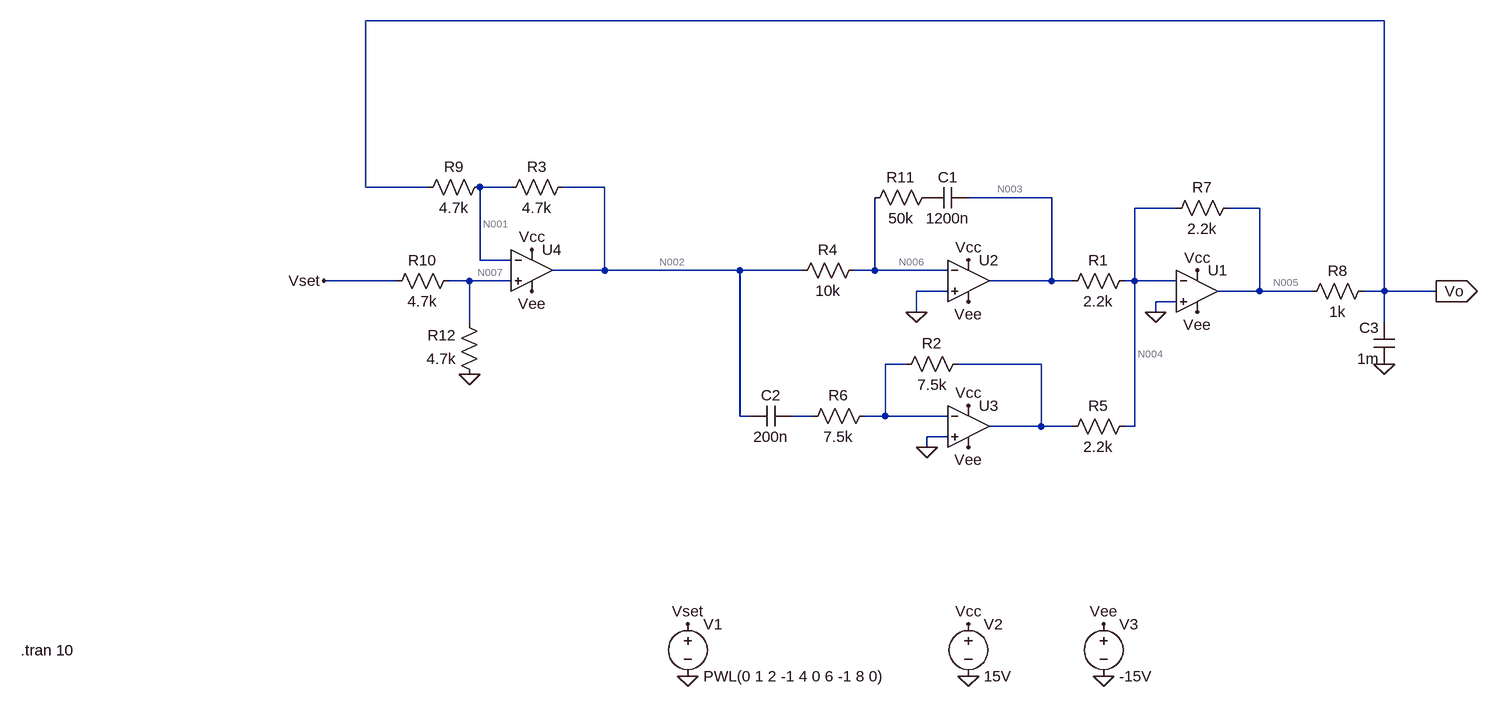
[diagram p0: schematic PID.asc]
PID.asc, the LTspice schematic file:
Version 4
SHEET 1 880 832
WIRE 560 -224 -1008 -224
WIRE -1008 32 -1008 -224
WIRE -912 32 -1008 32
WIRE -784 32 -832 32
WIRE -640 32 -704 32
WIRE 48 48 -80 48
WIRE 240 64 176 64
WIRE 368 64 320 64
WIRE -832 144 -832 32
WIRE -784 144 -832 144
WIRE -640 160 -640 32
WIRE -640 160 -720 160
WIRE -432 160 -640 160
WIRE -336 160 -432 160
WIRE -224 160 -224 48
WIRE -224 160 -256 160
WIRE -112 160 -224 160
WIRE -960 176 -1072 176
WIRE -848 176 -880 176
WIRE -784 176 -848 176
WIRE 48 176 48 48
WIRE 48 176 -48 176
WIRE 80 176 48 176
WIRE 176 176 176 64
WIRE 176 176 160 176
WIRE 240 176 176 176
WIRE -112 192 -160 192
WIRE 368 192 368 64
WIRE 368 192 304 192
WIRE 448 192 368 192
WIRE 560 192 560 -224
WIRE 560 192 528 192
WIRE 640 192 560 192
WIRE 240 208 208 208
WIRE -160 224 -160 192
WIRE 208 224 208 208
WIRE -848 240 -848 176
WIRE 560 240 560 192
WIRE -176 304 -208 304
WIRE 32 304 -96 304
WIRE -432 384 -432 160
WIRE -416 384 -432 384
WIRE -320 384 -352 384
WIRE -208 384 -208 304
WIRE -208 384 -240 384
WIRE -112 384 -208 384
WIRE 32 400 32 304
WIRE 32 400 -48 400
WIRE 80 400 32 400
WIRE 176 400 176 176
WIRE 176 400 160 400
WIRE -112 416 -144 416
WIRE -144 432 -144 416
FLAG -80 784 0
FLAG 128 784 0
FLAG -80 704 Vcc
FLAG 128 704 Vee
FLAG -80 432 Vee
FLAG -80 208 Vee
FLAG 272 224 Vee
FLAG -80 368 Vcc
FLAG -80 144 Vcc
FLAG 272 160 Vcc
FLAG 560 304 0
FLAG -512 784 0
FLAG -144 432 0
FLAG -160 224 0
FLAG 208 224 0
FLAG -752 192 Vee
FLAG -752 128 Vcc
FLAG -848 320 0
FLAG -512 704 Vset
FLAG -1072 176 Vset
FLAG 640 192 Vo
IOPIN 640 192 Out
SYMBOL OpAmps\\UniversalOpamp 272 192 R0
SYMATTR InstName U1
SYMBOL OpAmps\\UniversalOpamp -80 176 R0
SYMATTR InstName U2
SYMBOL OpAmps\\UniversalOpamp -80 400 R0
SYMATTR InstName U3
SYMBOL res 176 160 R90
WINDOW 0 0 56 VBottom 2
WINDOW 3 32 56 VTop 2
SYMATTR InstName R1
SYMATTR Value 2.2k
SYMBOL res -80 288 R90
WINDOW 0 0 56 VBottom 2
WINDOW 3 32 56 VTop 2
SYMATTR InstName R2
SYMATTR Value 7.5k
SYMBOL res -128 32 R90
WINDOW 0 0 56 VBottom 2
WINDOW 3 32 56 VTop 2
SYMATTR InstName R11
SYMATTR Value 50k
SYMBOL res -240 144 R90
WINDOW 0 0 56 VBottom 2
WINDOW 3 32 56 VTop 2
SYMATTR InstName R4
SYMATTR Value 10k
SYMBOL res 176 384 R90
WINDOW 0 0 56 VBottom 2
WINDOW 3 32 56 VTop 2
SYMATTR InstName R5
SYMATTR Value 2.2k
SYMBOL res -224 368 R90
WINDOW 0 0 56 VBottom 2
WINDOW 3 32 56 VTop 2
SYMATTR InstName R6
SYMATTR Value 7.5k
SYMBOL res 336 48 R90
WINDOW 0 0 56 VBottom 2
WINDOW 3 32 56 VTop 2
SYMATTR InstName R7
SYMATTR Value 2.2k
SYMBOL res 544 176 R90
WINDOW 0 0 56 VBottom 2
WINDOW 3 32 56 VTop 2
SYMATTR InstName R8
SYMATTR Value 1k
SYMBOL cap -80 32 R90
WINDOW 0 0 32 VBottom 2
WINDOW 3 32 32 VTop 2
SYMATTR InstName C1
SYMATTR Value 1200n
SYMBOL cap -352 368 R90
WINDOW 0 0 32 VBottom 2
WINDOW 3 32 32 VTop 2
SYMATTR InstName C2
SYMATTR Value 200n
SYMBOL cap 576 304 R180
WINDOW 0 24 56 Left 2
WINDOW 3 24 8 Left 2
SYMATTR InstName C3
SYMATTR Value 1m
SYMBOL voltage -512 688 R0
WINDOW 123 0 0 Left 0
WINDOW 39 0 0 Left 0
SYMATTR InstName V1
SYMATTR Value PWL(0 1 2 -1 4 0 6 -1 8 0)
SYMBOL voltage -80 688 R0
WINDOW 123 0 0 Left 0
WINDOW 39 0 0 Left 0
SYMATTR InstName V2
SYMATTR Value 15V
SYMBOL voltage 128 688 R0
WINDOW 123 0 0 Left 0
WINDOW 39 0 0 Left 0
SYMATTR InstName V3
SYMATTR Value -15V
SYMBOL OpAmps\\UniversalOpamp -752 160 R0
SYMATTR InstName U4
SYMBOL res -688 16 R90
WINDOW 0 0 56 VBottom 2
WINDOW 3 32 56 VTop 2
SYMATTR InstName R3
SYMATTR Value 4.7k
SYMBOL res -816 16 R90
WINDOW 0 0 56 VBottom 2
WINDOW 3 32 56 VTop 2
SYMATTR InstName R9
SYMATTR Value 4.7k
SYMBOL res -864 160 R90
WINDOW 0 0 56 VBottom 2
WINDOW 3 32 56 VTop 2
SYMATTR InstName R10
SYMATTR Value 4.7k
SYMBOL res -832 336 R180
WINDOW 0 36 76 Left 2
WINDOW 3 36 40 Left 2
SYMATTR InstName R12
SYMATTR Value 4.7k
TEXT -1456 744 Right 2 !.tran 10

The netlist it stands for:
* PID.asc
XU1 0 N004 Vcc Vee N005 level1 Avol=1Meg GBW=10Meg Vos=0 En=0 Enk=0 In=0 Ink=0 Rin=500Meg  ; pins In+ In- V+ V- OUT
XU2 0 N006 Vcc Vee N003 level1 Avol=1Meg GBW=10Meg Vos=0 En=0 Enk=0 In=0 Ink=0 Rin=500Meg  ; pins In+ In- V+ V- OUT
XU3 0 N008 Vcc Vee N009 level1 Avol=1Meg GBW=10Meg Vos=0 En=0 Enk=0 In=0 Ink=0 Rin=500Meg  ; pins In+ In- V+ V- OUT
R1 N004 N003 2.2k
R2 N009 N008 7.5k
R11 P001 N006 50k
R4 N006 N002 10k
R5 N004 N009 2.2k
R6 N008 N010 7.5k
R7 N005 N004 2.2k
R8 Vo N005 1k
C1 N003 P001 1200n
C2 N010 N002 200n
C3 0 Vo 1m
V1 Vset 0 PWL(0 1 2 -1 4 0 6 -1 8 0)
V2 Vcc 0 15V
V3 Vee 0 -15V
XU4 N007 N001 Vcc Vee N002 level1 Avol=1Meg GBW=10Meg Vos=0 En=0 Enk=0 In=0 Ink=0 Rin=500Meg  ; pins In+ In- V+ V- OUT
R3 N002 N001 4.7k
R9 N001 Vo 4.7k
R10 N007 Vset 4.7k
R12 0 N007 4.7k
.tran 10
.lib UniversalOpAmp1.lib
.backanno
.end

* Results of the author's LTspice run, read from the files saved beside the schematic
* Operating Point, zero values left out:
*   V(n004) = -1.716 µV
*   V(n005) = 1.106 V
*   V(vcc) = 15 V
*   V(vee) = -15 V
*   V(n006) = 1.609 µV
*   V(n003) = -1.106 V
*   V(p001) = 1.609 µV
*   V(n002) = 1.609 µV
*   V(vo) = 1 V
*   V(vset) = 1 V
*   V(n001) = 500 mV
*   V(n007) = 500 mV
*   I(R12) = -106.4 µA
*   I(R10) = -106.4 µA
*   I(R9) = -106.4 µA
*   I(R3) = -106.4 µA
*   I(R8) = -106.4 µA
*   I(R7) = 502.9 µA
*   I(R5) = -779.8 pA
*   I(R1) = 502.9 µA
*   I(V3) = 60 µA
*   I(V2) = -60 µA
*   I(V1) = -106.4 µA
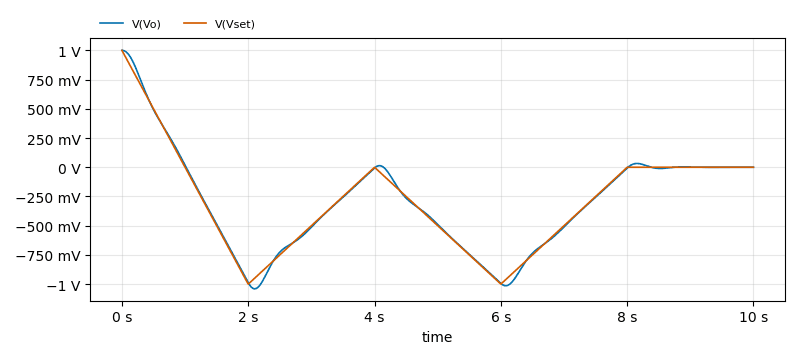
[diagram p1: Transient Analysis of PID.asc, plotted from the saved traces]
* Transient Analysis, 1 run:
*   V(Vo): min -1.04 V, max 1 V, average -298.7 mV, rms 525.4 mV, last -111.5 µV
*   V(Vset): min -1 V, max 1 V, average -300 mV, rms 516.7 mV, last 0 V